# EAGLE design emulator_reve (EAGLE 8.5.0)
Ekho Mobile Recording Front-End Board (Rev A) Provides signal conditioning, amplification, and adjustment for the I-V Controller.
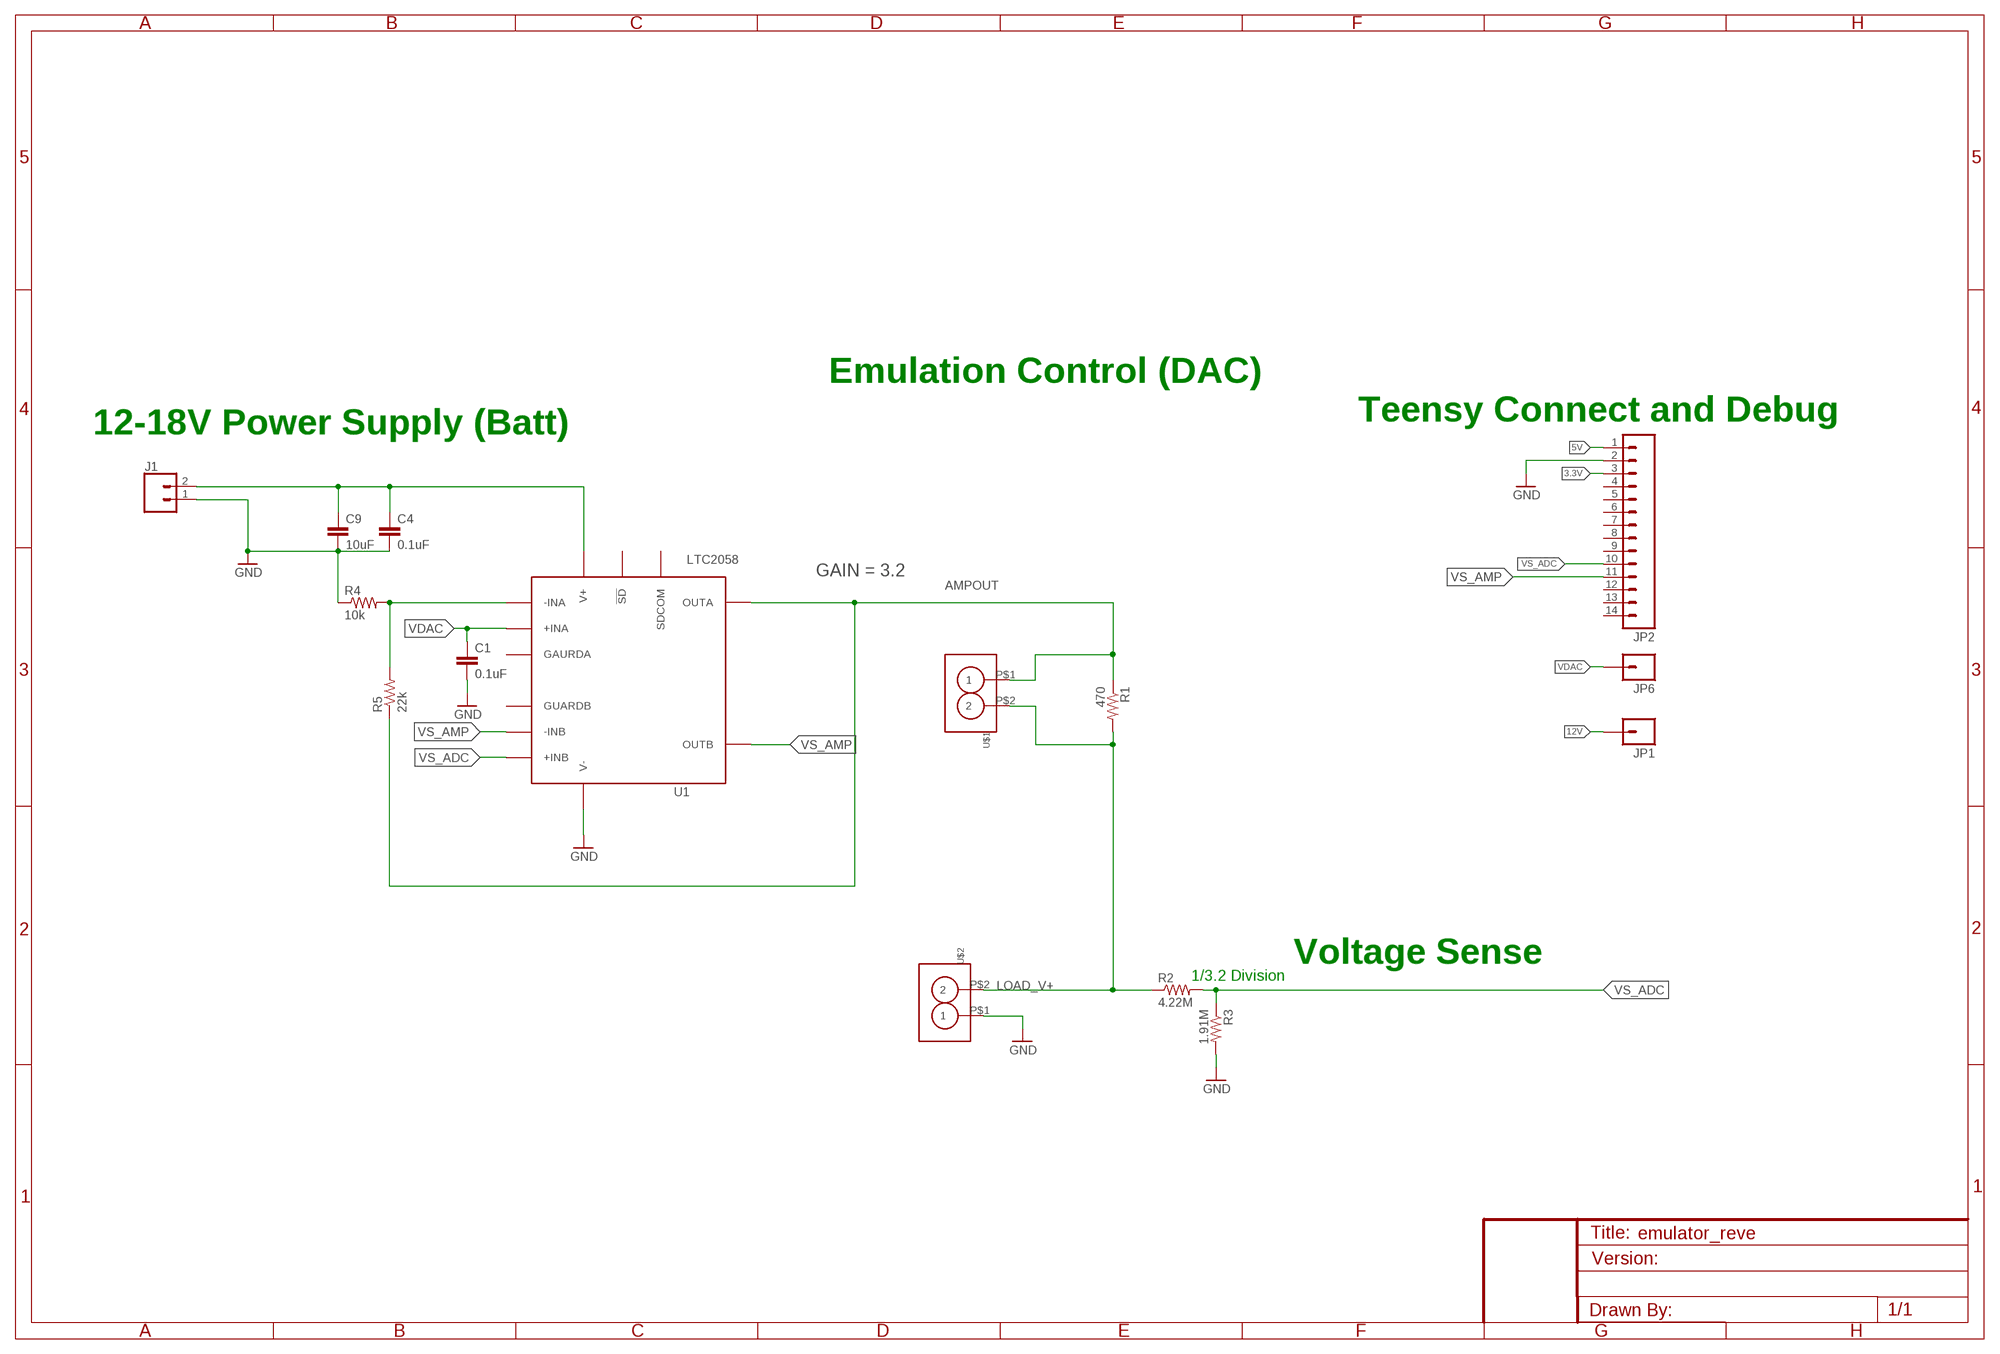
[diagram p0: schematic, sheet 1]

## Parts
C1  0.1uF  C-EU0603  [0603]
C4  0.1uF  C-EU0603  [0603]
C9  10uF  CAP1210  [1210]
J1  CONN_02  [1X02]
JP1  M01PTH  [1X01]
JP2  M14  [1X14]
JP6  M01PTH  [1X01]
R1  470  RESISTOR0805-RES  [0805]
R2  4.22M  R-EU0603  [0603]
R3  1.91M  R-EU0603  [0603]
R4  10k  R-EU0603  [0603]
R5  22k  R-EU0603  [0603]
U1  LTC2058  [MSOP12]
U$1  SCREW_CONNECTOR-2PIN'  [SCREW_CONNECTOR-2PIN-3.5MM]
U$2  SCREW_CONNECTOR-2PIN'  [SCREW_CONNECTOR-2PIN-3.5MM]

## Nets
3.3V: JP2.3
5V: JP2.1
12V: C4.1 C9.1 J1.2 JP1.1 U1.11(V+)
AMPOUT: R1.1 R5.1 U1.3(OUTA) U$1.P$1
GND: C1.2 C4.2 C9.2 J1.1 JP2.2 R3.2 R4.1 U1.2(V-) U1.EXP(V-) U$2.P$1
INA-: R4.2 R5.2 U1.5(-INA)
LOAD_V+: R1.2 R2.1 U$1.P$2 U$2.P$2
VDAC: C1.1 JP6.1 U1.6(+INA)
VS_ADC: JP2.10 R2.2 R3.1 U1.7(+INB)
VS_AMP: JP2.11 U1.8(-INB) U1.10(OUTB)
Unconnected: JP2.4 JP2.5 JP2.6 JP2.7 JP2.8 JP2.9 JP2.12 JP2.13 JP2.14 U1.1(!SD) U1.4(GAURDA) U1.9(GUARDB) U1.12(SDCOM)

## Notes on the sheet
- Emulation Control (DAC)
- Teensy Connect and Debug
- 12-18V Power Supply (Batt)
- GAIN = 3.2
- Voltage Sense
- 1/3.2 Division

## Library data of the parts
C1 C4 = tiny_passives:C-EU; DIGIKEY: 490-3271-1-ND
C9 = SparkFun-Capacitors:CAP: Capacitor Standard 0603 ceramic capacitor, and 0.1" leaded capacitor.; DIGIKEY: 490-1867-1-ND
J1 = SparkFun-Connectors:CONN_02: Multi connection point. Often used as Generic Header-pin footprint for 0.1 inch spaced/style header connections On any of the 0.1 inch spaced packages, you can populate with these: Break Away Headers - Straight <https://www.sparkfun.com/products/116> (PRT-00116) Break Away Male Headers - Right Angle <https://www.sparkfun.com/products/553> (PRT-00553) Female Headers <https://www.sparkfun.com/products/115> (PRT-00115) Break Away Headers - Machine Pin <https://www.sparkfun.com/products/117> (PRT-00117) Break Away Female Headers - Swiss Machine Pin <https://www.sparkfun.com/products/743> (PRT-00743) For SCREWTERMINALS and SPRING TERMINALS visit here: Screw Terimnals on SparkFun.com <https://www.sparkfun.com/search/results?term=Screw+Terminals> (5mm/3.5mm/2.54mm spacing) This device is also useful as a general connection point to wire up your design to another part of your project. Our various solder wires solder well into these plated through hole pads. Hook-Up Wire - Assortment (Stranded, 22 AWG) <https://www.sparkfun.com/products/11375> (PRT-11375) Hook-Up Wire - Assortment (Solid Core, 22 AWG) <https://www.sparkfun.com/products/11367> (PRT-11367) View the entire wire category on our website here <https://www.sparkfun.com/categories/141> Special notes: Molex polarized connector foot print use with: PRT-08233 with associated crimp pins and housings. 2.54_SCREWTERM for use with PRT-10571. 3.5mm Screw Terminal footprints for PRT-08084 5mm Screw Terminal footprints for use with PRT-08432
JP1 JP6 = SparkFun-Connectors:M01: Header 1 Standard 1-pin 0.1" header. Use with straight break away headers (SKU : PRT-00116), right angle break away headers (PRT-00553), swiss pins (PRT-00743), machine pins (PRT-00117), and female headers (PRT-00115). SMTSO-256-ET is a "flush mount" nut for a 4-40 screw. The older package used to be too tight, and did not allow it to sit properly thru the drill hit. The latest (0.165DIA) fits nice and snug.
JP2 = SparkFun-Connectors:M14: Header 14 Standard 14-pin 0.1" header. Use with straight break away headers (SKU : PRT-00116), right angle break away headers (PRT-00553), swiss pins (PRT-00743), machine pins (PRT-00117), and female headers (PRT-00115).
R1 = SparkFun-Passives:RESISTOR: Resistor Basic schematic elements and footprints for 0603, 1206, and PTH resistors.
R2 R3 = tiny_passives:R-EU; DIGIKEY: P2.0MJCT-ND
R4 R5 = tiny_passives:R-EU; DIGIKEY: 311-40.2KLRCT-ND
U1 = sorber:LTC2058
U$1 U$2 = BaseApp:SCREW_CONNECTOR-2PIN

## Board
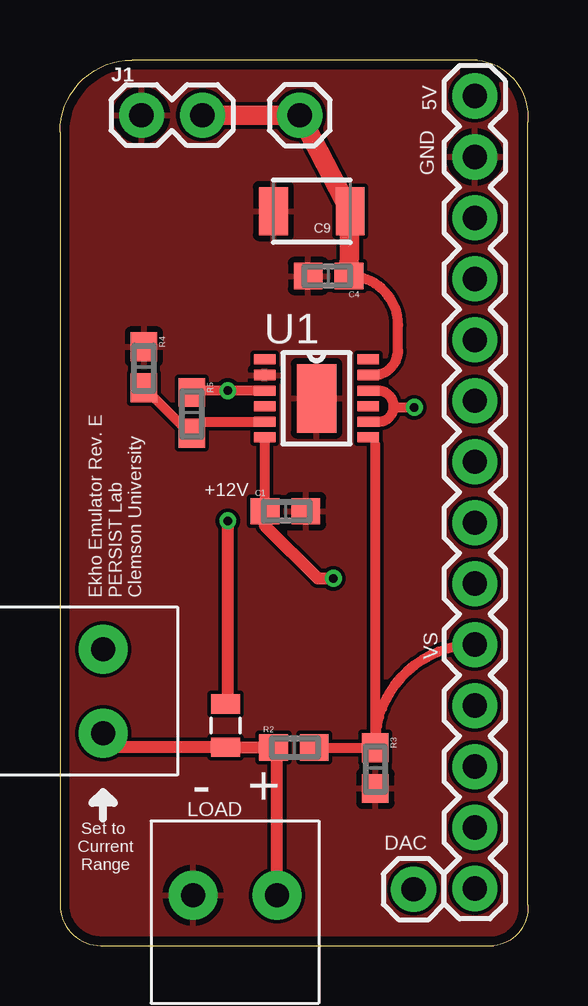
[diagram p1: board, top side]
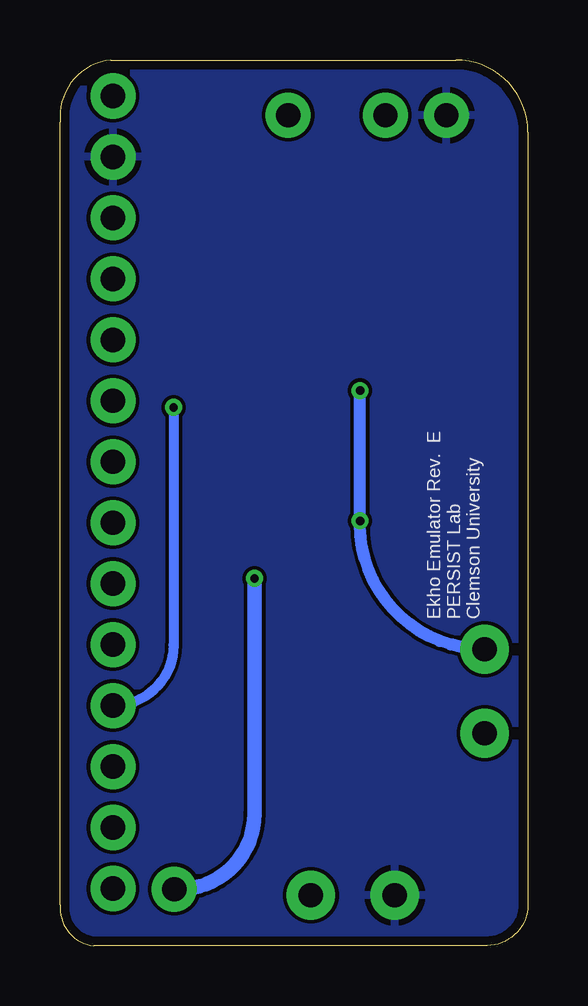
[diagram p2: board, bottom side, seen from below]

Size 19.51 x 36.9 mm. Coordinates in mm from the lower left corner, seen from the top.
Outline: 0,33.9 0,1.7 arc90 1.7,0 18.1,0 arc90 19.5,1.7 19.5,34.3 arc90 17.4,36.9 3,36.9 arc90 0,33.9
Copper layers (1+16): Top 0.0356mm / dielectric 1.5011mm / Bottom 0.0356mm
Design rules "LaenPCBOrder *": minimum track width 6mil, minimum drill 13mil, track to track 6mil, track to pad 6mil, pad to pad 6mil, via to via 6mil, smd to smd 6mil, copper to edge 15mil, drill to drill 6mil, minimum pad ring 7mil, minimum via ring 7mil, stop-mask expansion 3mil, vias tented up to drill 0mil, thermal gap 10mil

### Footprints (pad centres in the part's own frame; a part is rotated, then mirrored left to right if it is on the bottom)
0603 = smd 1.2 x 1.1: 1 -0.85,0; 2 0.85,0
1210 = smd 1.2 x 2: 1 -1.6,0; 2 1.6,0
1X02 = drill 1.016 pad 1.88: 1 0,0; 2 2.54,0
1X01 = drill 1.016 pad 1.88: 1 0,0
1X14 = drill 1.016 pad 1.88: 1 0,0; 2 2.54,0; 3 5.08,0; 4 7.62,0; 5 10.16,0; 6 12.7,0; 7 15.24,0; 8 17.78,0; 9 20.32,0; 10 22.86,0; 11 25.4,0; 12 27.94,0; 13 30.48,0; 14 33.02,0
0805 = smd 0.8 x 1.2: 1 -0.9,0; 2 0.9,0
MSOP12 = smd 0.9 x 0.42: 1 -2.163,1.625; 2 -2.163,0.975; 3 -2.163,0.325; 4 -2.163,-0.325; 5 -2.163,-0.975; 6 -2.163,-1.625; 7 2.15,-1.625; 8 2.15,-0.975; 9 2.15,-0.325; 10 2.15,0.325; 11 2.15,0.975; 12 2.15,1.625 | smd 1.65 x 2.85: EXP 0,0
SCREW_CONNECTOR-2PIN-3.5MM = drill 1.016 pad 2.032: P$1 -1.75,0; P$2 1.75,0

### Placement (x,y rotation side)
C1  9.4,18.1 0 top
C4  11.2,27.9 180 top
C9  10.5,30.6 180 top
J1  3.4,34.6 0 top
JP1  10,34.6 180 top
JP2  17.3,35.4 270 top
JP6  14.75,2.35 90 top
R1  6.9,9.17 270 top
R2  9.75,8.25 0 top
R3  13.15,7.4 270 top
R4  3.5,24.1 270 top
R5  5.5,22.2 270 top
U1  10.7,22.8 0 top
U$1  1.8,10.6 270 top
U$2  7.3,2.1 0 top

### Tracks (layer width: path | path; a pad name or v marks a point on that pad's centre or on a via)
5V
  Top 0.5: 17.2,35.5 JP2.1
12V
  Top 0.152: C9.1 12.1,30.8
  Top 0.254: U1.11 13.07,23.77
  Top 0.406: 13.07,23.77 arc90 14.1,24.8 14.1,25.85 arc90 C4.1
  Top 0.813: J1.2 JP1.1 C9.1 C4.1
AMPOUT  (via drill 0.35)
  Top 0.254: 5.58,23.12 arc90 R5.1 | R1.1 arc90 7,10.17
  Top 0.406: U1.3 v7,23.12 5.58,23.12
  Top 0.508: 7,10.17 v7,17.7
  Bottom 0.254: 7,17.55 v7,17.7
  Bottom 0.508: U$1.P$1 arc90 7,17.55 | v7,17.7 v7,23.12
GND
  Top 0.152: 3.45,25 R4.1 | 10.7,17.65 C1.2 | 13.1,6.5 R3.2
  pour Top: 22.1,37.2 0.5,37.2 0.1,-0.4 21.8,-0.4
  pour Bottom: 0.5,36.9 20.7,36.9 20.7,0.3 0.4,0.3 0.4,36.8 0.5,36.8
INA-
  Top 0.254: 5.98,21.82 R5.2 5.4,21.35
  Top 0.406: 5.98,21.82 U1.5 | R4.2 5.4,21.35
LOAD_V+
  Top 0.152: 9.05,8.1 R2.1 | 6.92,8.25 R1.2
  Top 0.508: U$2.P$2 9.05,8.1 | R2.1 6.92,8.25 | R1.2 2.38,8.27 U$1.P$2
VDAC  (via drill 0.35)
  Top 0.254: 8.54,18.11 C1.1
  Top 0.406: U1.6 8.54,18.11
  Top 0.508: v11.4,15.3 10.75,15.3 8.55,17.5 C1.1
  Bottom 0.254: JP6.1 14.55,2.35
  Bottom 0.61: 14.55,2.35 arc-90 11.4,5.5 v11.4,15.3
VS_ADC
  Top 0.152: 13,8.25 R3.1
  Top 0.254: R3.1 13.15,8.39 | 13.15,20.88 arc90 U1.7
  Top 0.406: 13.15,8.39 arc-90 JP2.10 | R2.2 13,8.25 | R3.1 13.15,20.88
VS_AMP  (via drill 0.35)
  Top 0.152: U1.8 13.3,21.82 | U1.10 13.27,23.12 | 13.9,22.5 13.9,22.43
  Top 0.406: 13.27,23.12 arc-90 13.9,22.5 | 13.3,21.82 arc90 13.9,22.43 v14.77,22.43
  Bottom 0.406: v14.77,22.43 14.77,12.52 arc90 JP2.11

### Text on the board
tPlace: 5V | GND | +12V | Ekho Emulator Rev. E / PERSIST Lab / Clemson University | VS | - | + | LOAD | Set to / Current / Range | DAC
bPlace: Ekho Emulator Rev. E / PERSIST Lab / Clemson University